# EAGLE design SmartThermo2.1 (EAGLE 8.4.0)
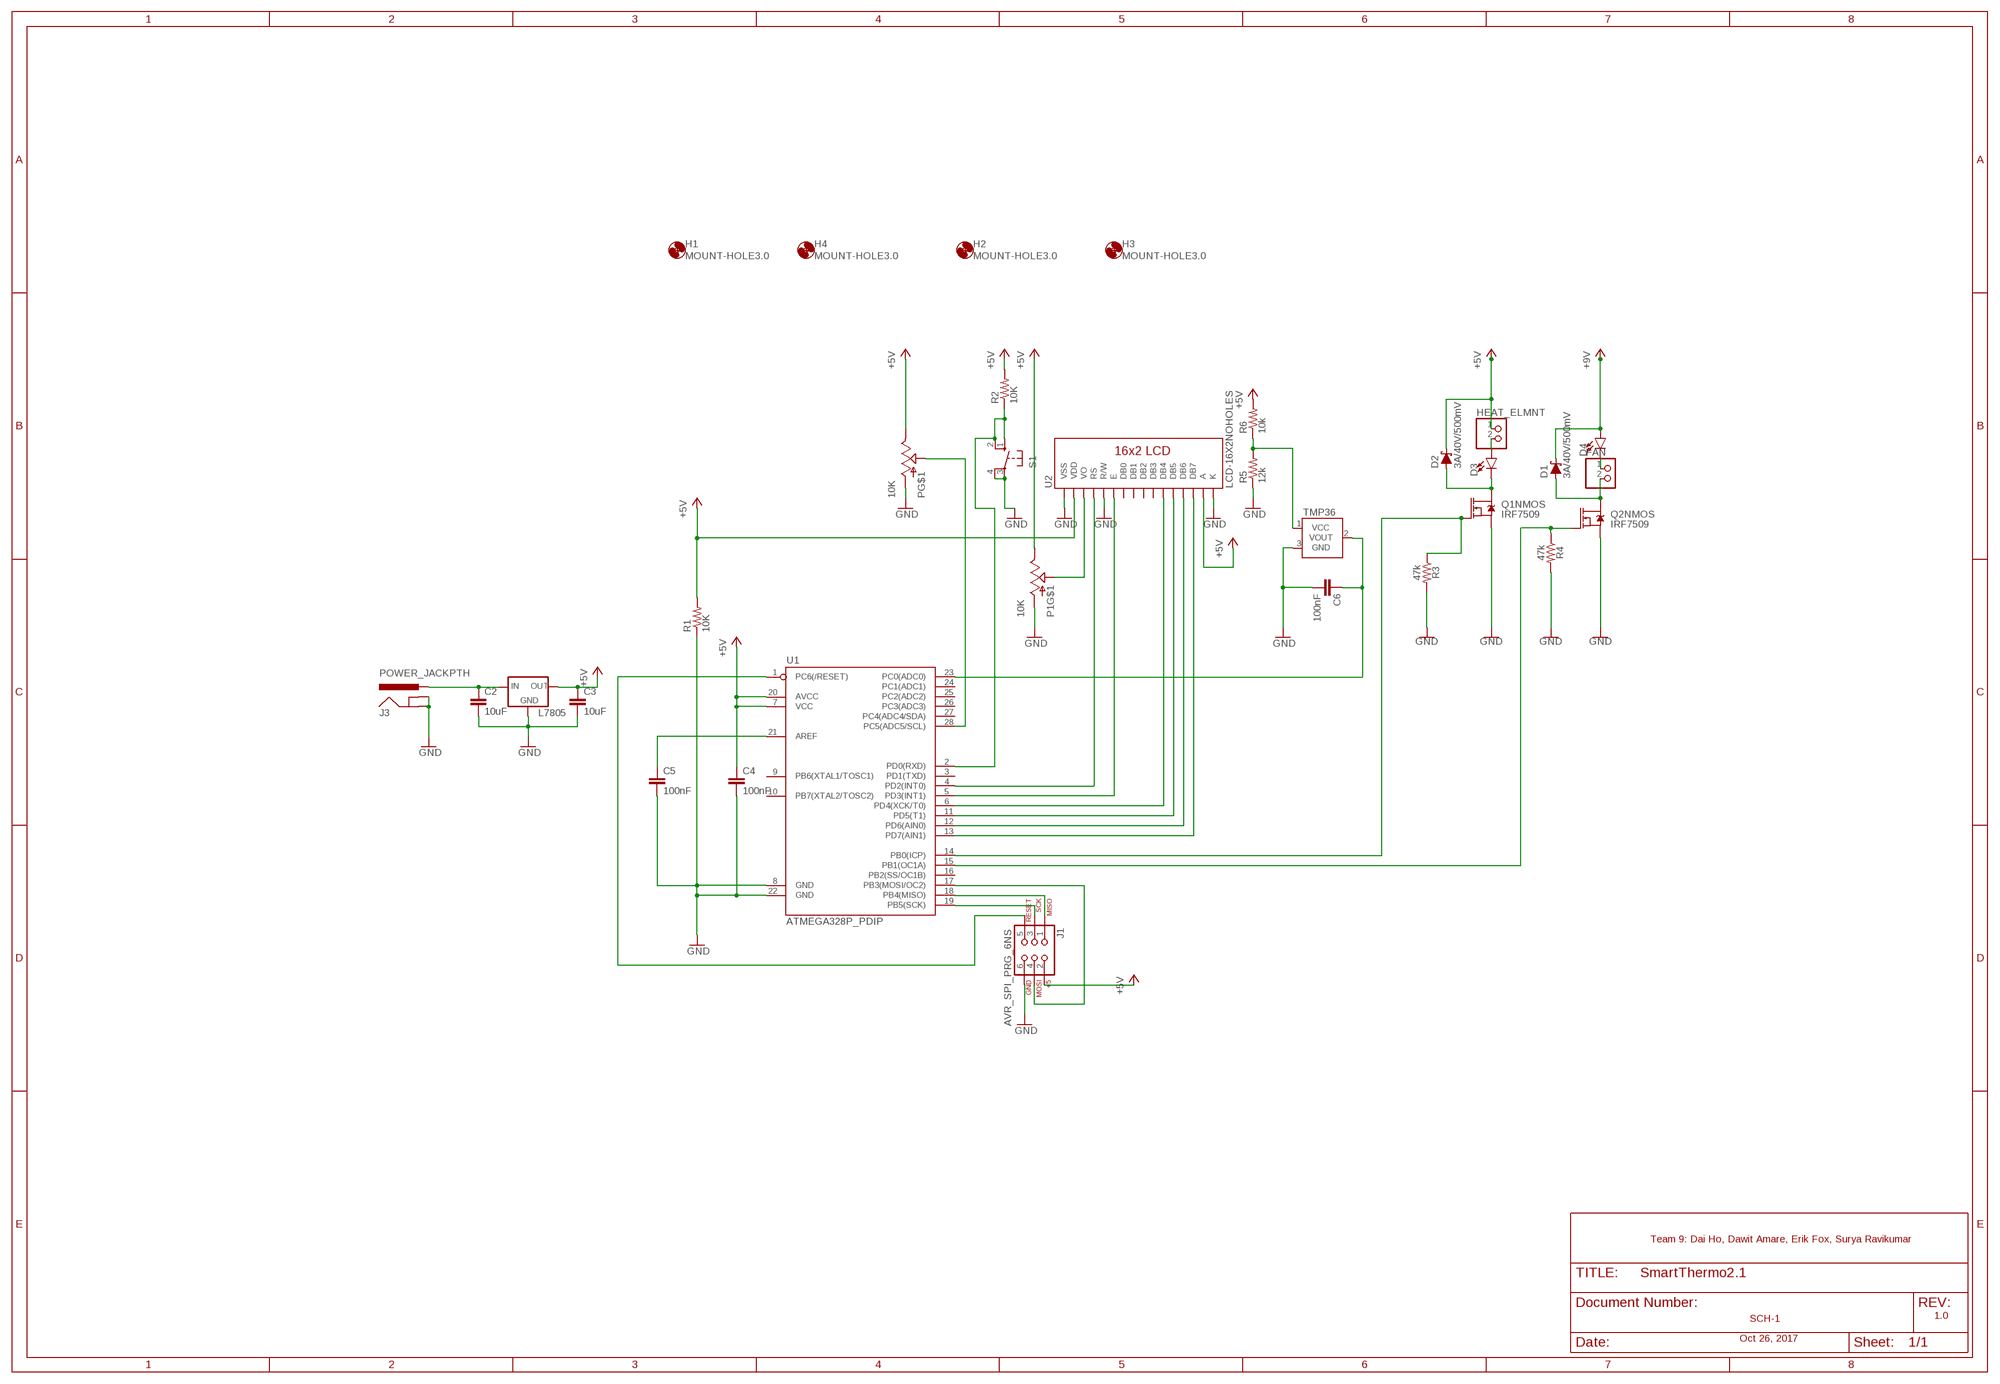
[diagram p0: schematic, sheet 1]

## Parts
C2  10uF  C7.5/3  [C7.5B3]
C3  10uF  C7.5/3  [C7.5B3]
C4  100nF  C2.5/2  [C2.5-2]
C5  100nF  C2.5/2  [C2.5-2]
C6  100nF  C2.5/2  [C2.5-2]
D1  3A/40V/500mV  DIODE-SCHOTTKY-B340A  [SMA-DIODE]
D2  3A/40V/500mV  DIODE-SCHOTTKY-B340A  [SMA-DIODE]
D3  LED3MM  [LED_3MM]
D4  LED3MM  [LED_3MM]
FAN  PINHD-1X2/90  [1X02/90]
H1  MOUNT-HOLE3.0  [3,0]
H2  MOUNT-HOLE3.0  [3,0]
H3  MOUNT-HOLE3.0  [3,0]
H4  MOUNT-HOLE3.0  [3,0]
HEAT_ELMNT  PINHD-1X2/90  [1X02/90]
J1  AVR_SPI_PRG_6NS  [2X3-NS]
J3  POWER_JACKPTH  [POWER_JACK_PTH]
L7805  78XXL  [78XXL]
P  10K  POT_SWITCHPOT_PTH  [POT_PTH]
P1  10K  POT_SWITCHPOT_PTH  [POT_PTH]
Q1  IRF7509  [MSOP8]
Q2  IRF7509  [MSOP8]
R1  10K  RESISTOR1206  [1206]
R2  10K  RESISTOR1206  [1206]
R3  47k  47KOHM-0603-1/10W-1%  [0603]
R4  47k  47KOHM-0603-1/10W-1%  [0603]
R5  12k  R-US_0204/5  [0204/5]
R6  10k  R-US_0204/5  [0204/5]
S1  10-XX  [B3F-10XX]
TMP36  TMP36GT9  [TO-92]
U1  ATMEGA328P_PDIP  [DIL28-3]
U2  LCD-16X2NOHOLES  [LCD-16X2_NOHOLES]

## Nets
+5V: C3.1 C4.1 D1.C D2.C D4.A HEAT_ELMNT.1 J1.2 L7805.OUT P1.E@2(E) P.E@2(E) R1.2 R2.2 R6.2 U1.7(VCC) U1.20(AVCC) U2.2(VDD) U2.15(A) ; supply symbol labelled +9V
GND: C2.2 C3.2 C4.2 C5.2 C6.2 J1.6 J3.GND J3.GNDBREAK L7805.GND P1.E@1(A) P.E@1(A) Q1.1(NMOS:S) Q2.1(NMOS:S) R1.1 R3.2 R4.2 R5.1 S1.3(P) S1.4(P1) TMP36.3(GND) U1.8(GND) U1.22(GND) U2.1(VSS) U2.5(R/W) U2.16(K)
N$2: C6.1 TMP36.2(VOUT) U1.23(PC0(ADC0))
N$3: P.WAND(S) U1.28(PC5(ADC5/SCL))
N$4: Q2.2(NMOS:G) R4.1 U1.15(PB1(OC1A))
N$5: U1.4(PD2(INT0)) U2.4(RS)
N$6: P1.WAND(S) U2.3(VO)
N$7: U1.5(PD3(INT1)) U2.6(E)
N$8: U1.6(PD4(XCK/T0)) U2.11(DB4)
N$9: U1.11(PD5(T1)) U2.12(DB5)
N$10: U1.12(PD6(AIN0)) U2.13(DB6)
N$11: U1.13(PD7(AIN1)) U2.14(DB7)
N$12: C2.1 J3.PWR L7805.IN
N$13: D1.A FAN.2 Q2.7(NMOS:D) Q2.8(NMOS:D)
N$14: R5.2 R6.1 TMP36.1(VCC)
N$15: R2.1 S1.1(S) S1.2(S1) U1.2(PD0(RXD))
N$16: J1.1 U1.18(PB4(MISO))
N$17: D3.A HEAT_ELMNT.2
N$18: J1.4 U1.17(PB3(MOSI/OC2))
N$19: Q1.2(NMOS:G) R3.1 U1.14(PB0(ICP))
N$20: J1.3 U1.19(PB5(SCK))
N$21: D2.A D3.K(C) Q1.7(NMOS:D) Q1.8(NMOS:D)
N$22: D4.K(C) FAN.1
N$26: C5.1 U1.21(AREF)
N$42: J1.5 U1.1(PC6(/RESET))
Unconnected: P1.S1 P1.S2 P.S1 P.S2 Q1.3(PMOS:S) Q1.4(PMOS:G) Q1.5(PMOS:D) Q1.6(PMOS:D) Q2.3(PMOS:S) Q2.4(PMOS:G) Q2.5(PMOS:D) Q2.6(PMOS:D) U1.3(PD1(TXD)) U1.9(PB6(XTAL1/TOSC1)) U1.10(PB7(XTAL2/TOSC2)) U1.16(PB2(SS/OC1B)) U1.24(PC1(ADC1)) U1.25(PC2(ADC2)) U1.26(PC3(ADC3)) U1.27(PC4(ADC4/SDA)) U2.7(DB0) U2.8(DB1) U2.9(DB2) U2.10(DB3)

## Notes on the sheet
- Team 9: Dai Ho, Dawit Amare, Erik Fox, Surya Ravikumar
- 1.0
- SCH-1
- Oct 26, 2017

## Library data of the parts
C2-C6 = capacitor-wima:C: CAPACITOR naming: grid - package width
D1 D2 = SparkFun-DiscreteSemi:DIODE-SCHOTTKY: Schottky diode A Schottky diode is a semiconductor diode which has a low forward voltage drop and a very fast switching action.; PROD_ID: DIO-09886
D3 D4 = SparkFun-LED:LED: LED (Generic) Standard schematic elements and footprints for 5mm, 3mm, 1206, and 0603 sized LEDs. Generic LEDs with no color specified.; PROD_ID: DIO-08794
FAN HEAT_ELMNT = pinhead:PINHD-1X2: PIN HEADER
H1-H4 = holes:MOUNT-HOLE: MOUNTING HOLE with drill center marker
J1 = SparkFun-Connectors:AVR_SPI_PRG_6: AVR ISP 6 Pin This is the reduced ISP connector for AVR programming. Common on Arduino. This footprint will take up less PCB space and can be used with a 10-pin to 6-pin adapter such as SKU: BOB-08508 **Special note about "TEST_POINT" package. The stop mask is on the top side, so if you want your programming test points to be on the bottom of your board, make sure to place this package on the bottom side of the board. This also ensure that the orientation to program from the bottom side will be correct.
J3 = SparkFun-Connectors:POWER_JACK: Power Jack This is the standard 5.5mm barrel jack for power. The PTH is the most common, proven, reliable, footprint. The Slot footprint only works if the mill layer is transmitted to the PCB fab house so be warned. Mating wall wart : TOL-00298 (and others); PROD_ID: CONN-08197
L7805 = v-reg:78XXL: VOLTAGE REGULATOR
P P1 = button_TestFootprint:POT_SWITCH: Potentiometer w/ switch.
Q1 Q2 = SparkFun-DiscreteSemi:IRF7509: Dual N and P Channel MOSFET Dual N/P-Channel 30V 1.25 W 7.8/7.5 nC Hexfet Power Mosfet Surface Mount-MICRO-8. NMOS RDS(ON) 0.11Ω. PMOS RDS(ON) 0.20Ω. Link to datasheet <http://www.irf.com/product-info/datasheets/data/irf7509pbf.pdf> SparkFun Products: SparkFun RedBot Mainboard <https://www.sparkfun.com/products/12097> SparkFun Wake on Shake <https://www.sparkfun.com/products/11447>; PROD_ID: TRANS-07913
R1 R2 = SparkFun-Passives:RESISTOR: Resistor Basic schematic elements and footprints for 0603, 1206, and PTH resistors.
R3 R4 = SparkFun-Resistors:47KOHM: 47kΩ resistor A resistor is a passive two-terminal electrical component that implements electrical resistance as a circuit element. Resistors act to reduce current flow, and, at the same time, act to lower voltage levels within circuits. - Wikipedia; PROD_ID: RES-07871
R5 R6 = resistor:R-US_: RESISTOR, American symbol
S1 = switch-omron:10-XX: OMRON SWITCH; MPN: B3F-1000; OC_FARNELL: 176432; OC_NEWARK: 36M3542
TMP36 = SparkFun-Sensors:TMP36: Precision degC temp sensor, analog out
U1 = SparkFun-DigitalIC:ATMEGA328P_PDIP: uC used in the Arduino 32kb flash, 1k EEPROM, 2k SRAM This is the through-hole version of this chip.
U2 = SparkFun-Displays:LCD-16X2: Standard text-only 16x2 parallel input LCD

## Net classes
0 default: clearance 0.205 mm

## Board
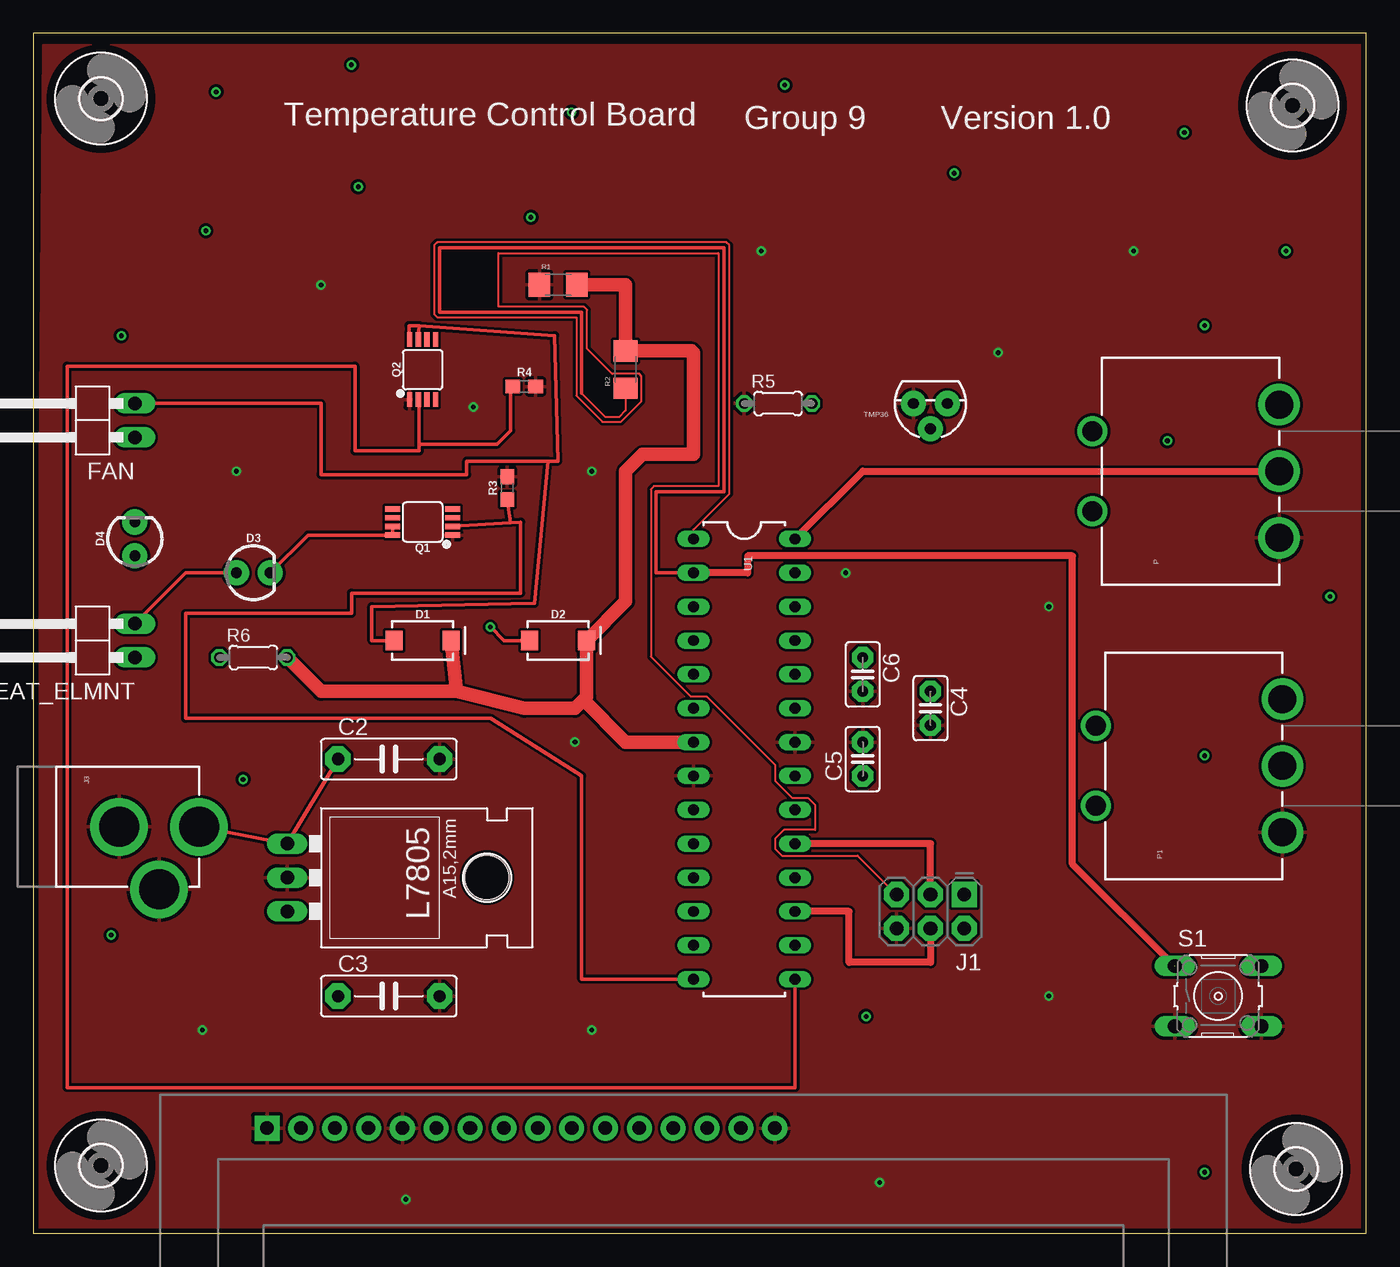
[diagram p1: board, top side]
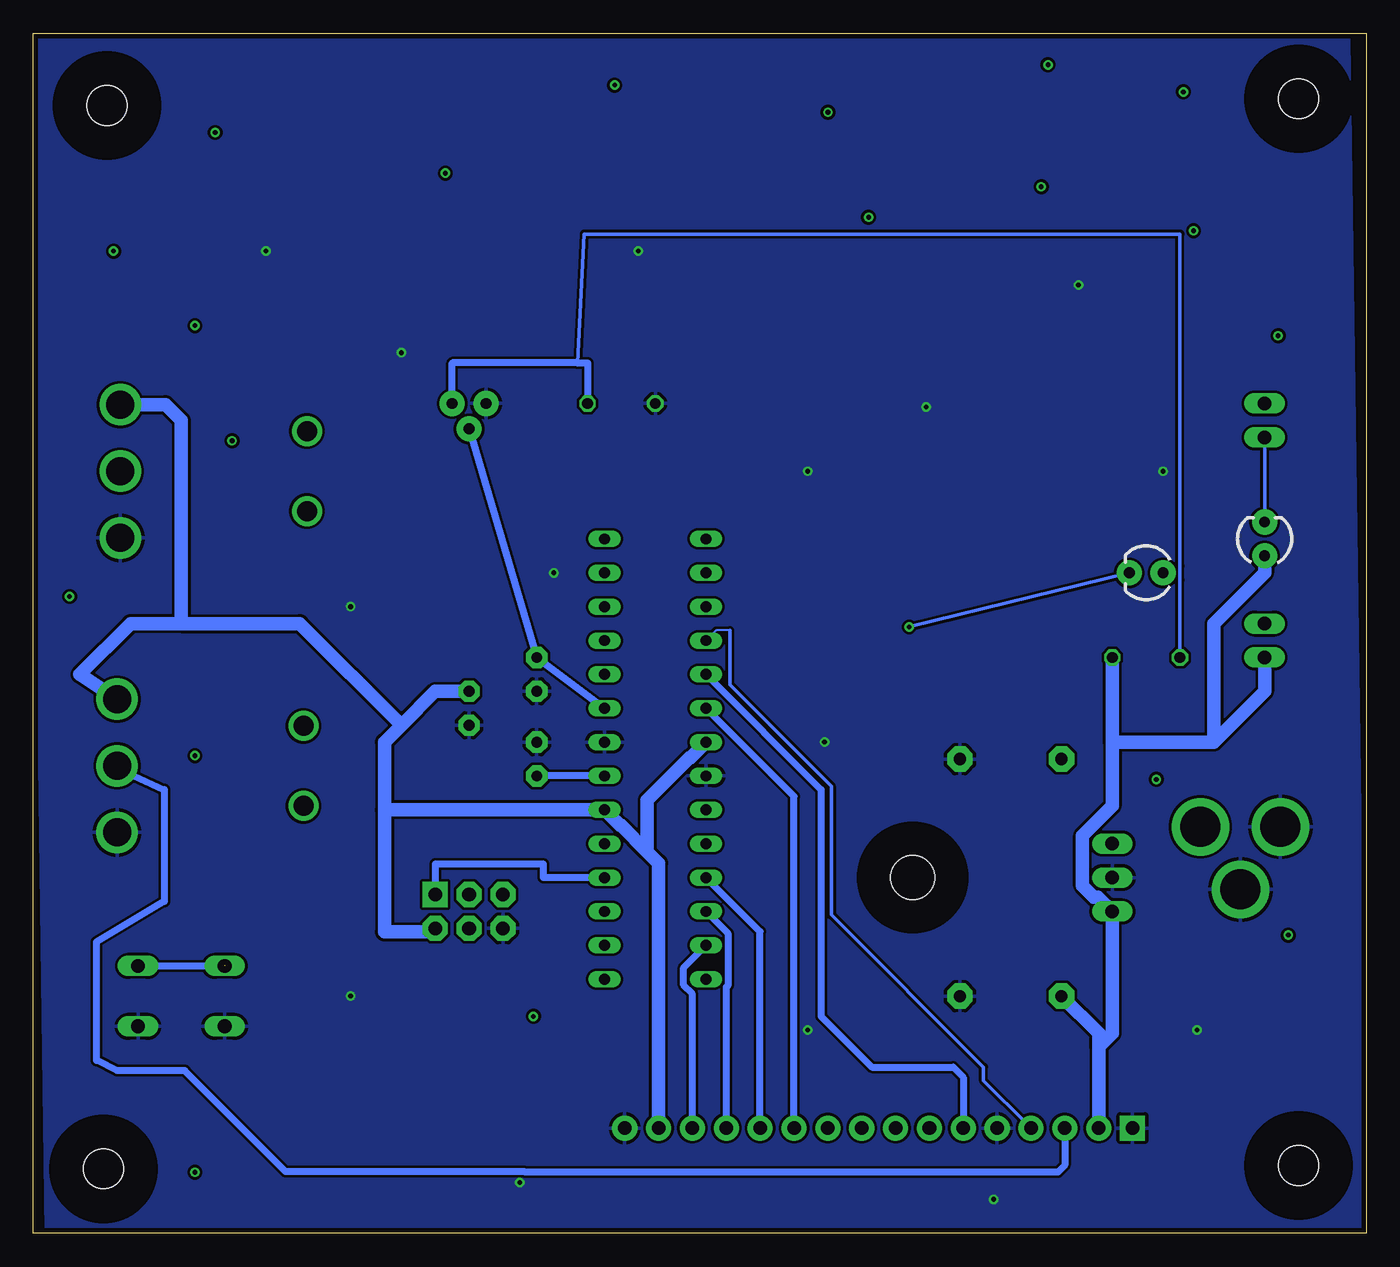
[diagram p2: board, bottom side, seen from below]

Size 100.01 x 89.99 mm. Coordinates in mm from the lower left corner, seen from the top.
Outline: 0,0 100,0 100,89.99 0,89.99 0,0
Copper layers (1*16): Top 0.0356mm / dielectric 1.5011mm / Bottom 0.0356mm
Design rules "oshpark-2layer": minimum track width 6mil, minimum drill 13mil, track to track 6mil, track to pad 6mil, pad to pad 6mil, via to via 6mil, smd to smd 6mil, copper to edge 15mil, drill to drill 6mil, minimum pad ring 7mil, minimum via ring 7mil, stop-mask expansion 2.5mil, vias tented up to drill 0mil, thermal gap 10mil

### Footprints (pad centres in the part's own frame; a part is rotated, then mirrored left to right if it is on the bottom)
C7.5B3 = drill 0.914 pad 1.905 octagon: 1 -3.81,0; 2 3.81,0
C2.5-2 = drill 0.813 pad 1.6 octagon: 1 -1.27,0; 2 1.27,0
SMA-DIODE = smd 1.27 x 1.47: A -2.15,0; C 2.15,0
LED_3MM = drill 0.813 pad 1.88: A -1.27,0; K 1.27,0
1X02/90 = drill 1.016 long: 1 -1.27,-3.81; 2 1.27,-3.81
3,0 = hole 3: 0,0
2X3-NS = drill 1.016 pad 1.88 square: 1 -2.54,-1.27 | drill 1.016 pad 1.88 octagon: 2 -2.54,1.27; 3 0,-1.27; 4 0,1.27; 5 2.54,-1.27; 6 2.54,1.27
POWER_JACK_PTH = drill 2.997 pad 4.318: GND 0,7.7; GNDBREAK 4.7,10.7; PWR 0,13.7
78XXL = drill 1.016 long: GND 0,-3.81; IN -2.54,-3.81; OUT 2.54,-3.81 | hole 3.302: 0,11.176
POT_PTH = drill 2.1: E@1 -5,0; E@2 5,0; WAND 0,0 | drill 1.5: S1 -3,14; S2 3,14
MSOP8 = smd 0.4 x 1.1: 1 -0.975,-2.25; 2 -0.325,-2.25; 3 0.325,-2.25; 4 0.975,-2.25; 5 0.975,2.25; 6 0.325,2.25; 7 -0.325,2.25; 8 -0.975,2.25
1206 = smd 1.6 x 1.8: 1 -1.4,0; 2 1.4,0
0603 = smd 1.1 x 1: 1 -0.85,0; 2 0.85,0
0204/5 = drill 0.813 octagon: 1 -2.54,0; 2 2.54,0
B3F-10XX = drill 1.016 long: 1 -3.251,2.261; 2 3.251,2.261; 3 -3.251,-2.261; 4 3.251,-2.261
TO-92 = drill 0.813 pad 1.88: 1 -1.27,0; 2 0,1.905; 3 1.27,0
DIL28-3 = drill 0.813 long: 1 -16.51,-3.81; 2 -13.97,-3.81; 3 -11.43,-3.81; 4 -8.89,-3.81; 5 -6.35,-3.81; 6 -3.81,-3.81; 7 -1.27,-3.81; 8 1.27,-3.81; 9 3.81,-3.81; 10 6.35,-3.81; 11 8.89,-3.81; 12 11.43,-3.81; 13 13.97,-3.81; 14 16.51,-3.81; 15 16.51,3.81; 16 13.97,3.81; 17 11.43,3.81; 18 8.89,3.81; 19 6.35,3.81; 20 3.81,3.81; 21 1.27,3.81; 22 -1.27,3.81; 23 -3.81,3.81; 24 -6.35,3.81; 25 -8.89,3.81; 26 -11.43,3.81; 27 -13.97,3.81; 28 -16.51,3.81
LCD-16X2_NOHOLES = drill 1.016 pad 1.88 square: 1 -32,15.5 | drill 1.016 pad 1.88: 2 -29.46,15.5; 3 -26.92,15.5; 4 -24.38,15.5; 5 -21.84,15.5; 6 -19.3,15.5; 7 -16.76,15.5; 8 -14.22,15.5; 9 -11.68,15.5; 10 -9.14,15.5; 11 -6.6,15.5; 12 -4.06,15.5; 13 -1.52,15.5; 14 1.02,15.5; 15 3.56,15.5; 16 6.1,15.5

### Placement (x,y rotation side)
C2  26.67,35.56 0 top
C3  26.67,17.78 0 top
C4  67.31,39.37 270 top
C5  62.23,35.56 90 top
C6  62.23,41.91 270 top
D1  29.21,44.45 0 top
D2  39.37,44.45 0 top
D3  16.51,49.53 0 top
D4  7.62,52.07 90 top
FAN  3.81,60.96 90 top
H1  94.74,4.83 0 top
H2  5.08,5.08 0 top
H3  5.08,85.09 0 top
H4  94.49,84.58 0 top
HEAT_ELMNT  3.81,44.45 90 top
J1  67.31,24.13 180 top
J3  -1.27,30.48 270 top
L7805  22.86,26.67 270 top
P  93.47,57.15 90 top
P1  93.73,35.05 90 top
Q1  29.21,53.34 90 top
Q2  29.21,64.77 0 top
R1  39.37,71.12 0 top
R2  44.45,64.77 90 top
R3  35.56,55.88 90 top
R4  36.83,63.5 0 top
R5  55.88,62.23 0 top
R6  16.51,43.18 0 top
S1  88.9,17.78 0 top
TMP36  67.31,62.23 180 top
U1  53.34,35.56 270 top
U2  49.53,-7.62 0 top

### Tracks (layer width: path | path; a pad name or v marks a point on that pad's centre or on a via)
+5V
  Top 1.016: R1.2 44.45,71.12 R2.2 49.4,66.17 49.53,66.04 49.53,58.42 45.72,58.42 44.45,57.15 44.45,47.38 D2.C 41.52,40.25 41.27,40.01 | R6.2 21.59,40.64 31.75,40.64 | 41.27,40.01 40.64,39.37 36.83,39.37 31.75,40.64 | U1.7 44.45,36.83 41.27,40.01 | 31.75,40.64 D1.C
  Bottom 1.016: 20.07,13.97 U2.2 | 20.07,13.97 20.07,14.99 C3.1 | 20.07,13.97 19.05,14.99 L7805.OUT 20.11,25.2 20.42,25.2 21.29,26.06 21.29,29.82 19.05,32.06 19.05,36.83 | 19.05,36.83 R6.2 | HEAT_ELMNT.1 7.62,40.64 11.43,36.83 | 11.43,36.83 19.05,36.83 | D4.A 7.62,49.53 11.43,45.72 11.43,36.83 | U2.15 53.09,27.75 53.94,28.61 | 53.94,28.61 55.92,30.58 55.98,30.58 U1.20 73.66,31.75 | 73.66,31.75 73.66,36.83 72.39,38.1 | 72.39,38.1 69.85,40.64 C4.1 | P1.E@2 96.52,41.91 92.71,45.72 88.9,45.72 | 88.9,45.72 80.01,45.72 72.39,38.1 | P.E@2 90.09,62.15 88.9,60.96 88.9,45.72 | U1.7 50.7,35.66 50.76,35.66 53.94,32.48 53.94,28.61 | 73.66,31.75 73.66,22.61 70.1,22.61 J1.2
GND  (via drill 0.35)
  other vias: 72.39,66.04 76.2,46.99 76.2,17.78 40.64,36.83 41.91,15.24 12.7,15.24 15.24,57.15 21.59,71.12 54.61,73.66 41.91,57.15 82.55,73.66 63.5,3.81 27.94,2.54 60.96,49.53 33.02,61.98
  pour Top: 0,0 0.76,89.15 101.09,89.15 100.33,0
  pour Bottom: 0,0 99.06,0 100.33,89.66 1.27,89.66
N$1  (via drill 0.35)
  other vias: 97.28,47.75
N$2
  Bottom 0.508: U1.23 C6.1 TMP36.2
N$3
  Top 0.508: P.WAND 62.23,57.15 U1.28
N$4
  Top 0.254: U1.15 57.15,10.92 2.54,10.92 2.54,65.02 24.13,65.02 24.13,58.67 28.96,58.67 28.96,59.18 | 28.96,59.18 28.96,62.45 arc90 Q2.2 | 28.96,59.18 34.8,59.18 35.81,60.2 35.81,63.5 R4.1
N$5
  Bottom 0.152: 47.75,45.21 48.77,45.21 U1.4
  Bottom 0.254: U2.4 25.4,8.13 28.7,11.43 28.7,12.45 40.13,23.88 40.13,33.53 47.75,41.15 47.75,45.21
N$6
  Bottom 0.508: U2.3 22.61,5.08 23.11,4.57 63.11,4.57 63.16,4.62 81.08,4.62 88.65,12.19 93.73,12.19 95.25,12.95 95.25,21.84 90.17,24.89 90.17,33.27 92.46,34.29 93.73,35.56 P1.WAND
N$7
  Bottom 0.508: U1.5 40.89,33.27 40.89,16.26 37.08,12.45 30.99,12.45 30.23,11.69 U2.6
N$8
  Bottom 0.508: U2.11 42.93,32.77 U1.6
N$9
  Bottom 0.508: U2.12 45.47,22.61 U1.11
N$10
  Bottom 0.508: U2.13 48.01,18.45 47.85,18.61 47.85,22.45 U1.12
N$11
  Bottom 0.508: U2.14 50.55,17.95 51.21,18.61 51.21,19.91 U1.13
N$12
  Top 0.254: J3.PWR L7805.IN C2.1
N$13
  Top 0.254: FAN.2 21.59,62.23 21.59,56.9 32.51,56.9 32.51,57.91 38.61,57.91 | 38.61,57.91 39.37,57.91 39.12,67.31 28.96,68.07 | 28.96,68.07 28.19,68.07 Q2.8 | Q2.7 28.96,68.07 | D1.A 25.4,44.45 25.4,46.99 37.59,47.24 38.61,57.91
N$14
  Bottom 0.254: R6.1 13.97,49 13.97,50.06 13.97,74.93 58.67,74.93 59.18,65.28
  Bottom 0.508: TMP36.1 68.58,65.28 59.18,65.28 58.42,65.28 R5.2
N$15  (1 unrouted)
  Top 0.152: R2.1 44.45,61.72 43.94,61.21 42.93,61.21 41.15,62.99
  Top 0.254: U1.2 46.74,49.53 46.74,55.63 51.82,55.63 51.82,73.91 30.48,73.91 30.48,69.09 41.15,69.09 41.15,62.99
  Top 0.508: 44.45,63.82 R2.1 | 85.6,20.07 77.98,27.69 77.98,50.8 53.59,50.8 53.59,49.53 U1.2
  Bottom 0.508: S1.2 S1.1
N$16
  Bottom 0.508: U1.18 61.72,26.67 61.72,27.69 69.85,27.69 J1.1
N$17
  Top 0.254: D3.A 11.43,49.53 HEAT_ELMNT.2
N$18
  Top 0.508: J1.4 67.31,20.32 61.21,20.32 61.21,24.13 U1.17
N$19
  Top 0.254: U1.14 41.15,19.05 41.15,34.29 34.29,38.61 11.43,38.61 11.43,46.48 23.88,46.48 23.88,48.01 36.58,48.01 36.58,53.34 35.82,53.29 | 35.82,53.29 Q1.2 | 35.82,53.29 R3.1
N$20
  Top 0.508: J1.3 67.31,29.21 U1.19
N$21  (via drill 0.35)
  Top 0.254: Q1.7 Q1.8 20.61,52.37 D3.K | D2.A 35.31,44.45 v34.29,45.47
  Bottom 0.254: v34.29,45.47 D3.K
N$22
  Bottom 0.254: D4.K FAN.1
N$23  (via drill 0.35)
  other vias: 87.88,68.07
N$24  (via drill 0.35)
  other vias: 87.88,35.81
N$25  (via drill 0.35)
  other vias: 85.09,59.44
N$26
  Bottom 0.508: U1.21 C5.1
N$27  (via drill 0.35)
  other vias: 62.48,16.26
N$28  (via drill 0.35)
  other vias: 87.88,4.57
N$29  (via drill 0.35)
  other vias: 15.75,34.04
N$30  (via drill 0.35)
  other vias: 5.84,22.35
N$31  (via drill 0.35)
  other vias: 6.6,67.31
N$32  (via drill 0.35)
  other vias: 12.95,75.18
N$33  (via drill 0.35)
  other vias: 37.34,76.2
N$34  (via drill 0.35)
  other vias: 56.39,86.11
N$35  (via drill 0.35)
  other vias: 69.09,79.5
N$36  (via drill 0.35)
  other vias: 23.88,87.63
N$37  (via drill 0.35)
  other vias: 24.38,78.49
N$38  (via drill 0.35)
  other vias: 40.39,84.07
N$39  (via drill 0.35)
  other vias: 86.36,82.55
N$40  (via drill 0.35)
  other vias: 93.98,73.66
N$41  (via drill 0.35)
  other vias: 13.72,85.6
N$42  (via drill 0.35)
  Top 0.152: U1.1 49.53,52.76 52.22,55.46 52.22,74.08 51.98,74.32 30.31,74.32 30.07,74.08 30.07,68.92 30.31,68.68 40.74,68.68 40.74,62.82 42.71,60.86 44.09,60.86 45.63,62.4 45.63,64.29 45.47,64.45 43.43,64.45 41.56,66.33 41.56,69.26 41.32,69.5 34.9,69.5 34.9,73.51 51.41,73.51 51.41,56.03 46.57,56.03 46.33,55.8 46.33,43.24 49.31,40.26 50.51,40.26 55.65,35.12 55.65,33.92 56.93,32.64 58.13,32.64 58.65,32.12 58.65,30.24 56.31,30.24 55.65,29.58 55.65,28.84 56.17,28.32 61.85,28.32 J1.5
  other vias: 64.77,25.4

### Text on the board
tPlace: Group 9 | Temperature Control Board | Version 1.0